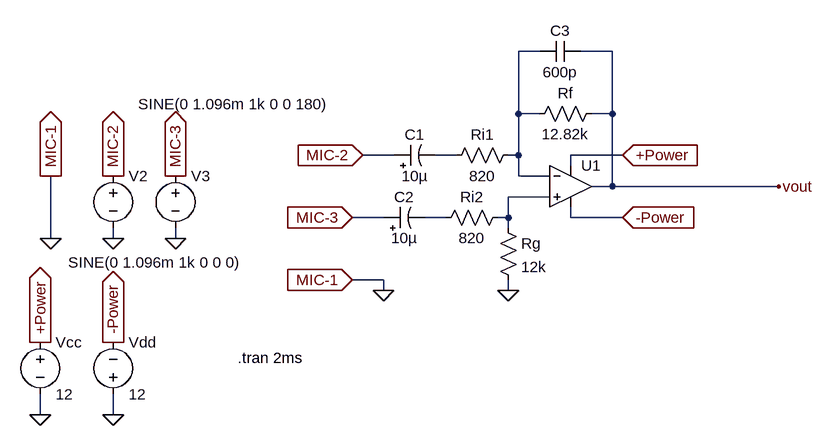
[diagram p0: schematic Mic Preamp.asc]
Mic Preamp.asc, the LTspice schematic file:
Version 4.1
SHEET 1 880 680
WIRE 304 -32 272 -32
WIRE 416 -32 368 -32
WIRE 272 64 272 -32
WIRE 304 64 272 64
WIRE 416 64 416 -32
WIRE 416 64 384 64
WIRE 80 128 32 128
WIRE 176 128 144 128
WIRE 272 128 272 64
WIRE 272 128 256 128
WIRE 432 128 352 128
WIRE 352 144 352 128
WIRE 272 160 272 128
WIRE 320 160 272 160
WIRE 416 176 416 64
WIRE 416 176 384 176
WIRE 672 176 416 176
WIRE 320 192 256 192
WIRE 64 224 16 224
WIRE 160 224 128 224
WIRE 256 224 256 192
WIRE 256 224 240 224
WIRE 352 224 352 208
WIRE 432 224 352 224
WIRE 256 240 256 224
WIRE -448 256 -448 160
WIRE -352 256 -352 240
WIRE -256 256 -256 240
WIRE 64 320 16 320
WIRE 64 336 64 320
WIRE 256 336 256 320
WIRE -464 528 -464 496
WIRE -352 528 -352 496
FLAG 432 128 +Power
IOPIN 432 128 In
FLAG 432 224 -Power
IOPIN 432 224 In
FLAG 256 336 0
FLAG 32 128 MIC-2
IOPIN 32 128 In
FLAG 16 224 MIC-3
IOPIN 16 224 In
FLAG 16 320 MIC-1
IOPIN 16 320 In
FLAG 64 336 0
FLAG -448 160 MIC-1
IOPIN -448 160 Out
FLAG -352 160 MIC-2
IOPIN -352 160 Out
FLAG -256 160 MIC-3
IOPIN -256 160 Out
FLAG -256 256 0
FLAG -352 256 0
FLAG -448 256 0
FLAG -352 416 -Power
IOPIN -352 416 Out
FLAG -464 416 +Power
IOPIN -464 416 Out
FLAG -464 528 0
FLAG -352 528 0
FLAG 672 176 vout
SYMBOL res 272 112 R90
WINDOW 0 0 56 VBottom 2
WINDOW 3 32 56 VTop 2
SYMATTR InstName Ri1
SYMATTR Value 820
SYMBOL res 256 208 R90
WINDOW 0 0 56 VBottom 2
WINDOW 3 32 56 VTop 2
SYMATTR InstName Ri2
SYMATTR Value 820
SYMBOL res 400 48 R90
WINDOW 0 0 56 VBottom 2
WINDOW 3 32 56 VTop 2
SYMATTR InstName Rf
SYMATTR Value 12.82k
SYMBOL res 240 224 R0
SYMATTR InstName Rg
SYMATTR Value 12k
SYMBOL voltage -352 144 R0
WINDOW 3 -69 149 Left 2
WINDOW 123 0 0 Left 0
WINDOW 39 0 0 Left 0
SYMATTR Value SINE(0 1.096m 1k 0 0 0)
SYMATTR InstName V2
SYMBOL voltage -256 144 R0
WINDOW 3 -57 -95 Left 2
WINDOW 123 0 0 Left 0
WINDOW 39 0 0 Left 0
SYMATTR Value SINE(0 1.096m 1k 0 0 180)
SYMATTR InstName V3
SYMBOL voltage -464 400 R0
WINDOW 123 0 0 Left 0
WINDOW 39 0 0 Left 0
SYMATTR InstName Vcc
SYMATTR Value 12
SYMBOL voltage -352 512 M180
WINDOW 0 24 96 Left 2
WINDOW 3 24 16 Left 2
WINDOW 123 0 0 Left 0
WINDOW 39 0 0 Left 0
SYMATTR InstName Vdd
SYMATTR Value 12
SYMBOL OpAmps\\UniversalOpAmp 352 176 R0
SYMATTR InstName U1
SYMBOL polcap 80 144 R270
WINDOW 0 32 32 VTop 2
WINDOW 3 0 32 VBottom 2
SYMATTR InstName C1
SYMATTR Value 10µ
SYMBOL polcap 64 240 R270
WINDOW 0 32 32 VTop 2
WINDOW 3 0 32 VBottom 2
SYMATTR InstName C2
SYMATTR Value 10µ
SYMBOL cap 368 -48 R90
WINDOW 0 0 32 VBottom 2
WINDOW 3 32 32 VTop 2
SYMATTR InstName C3
SYMATTR Value 600p
TEXT -160 440 Left 2 !.tran 2ms

The netlist it stands for:
* Mic Preamp.asc
Ri1 N001 N002 820
Ri2 N003 N004 820
Rf vout N001 12.82k
Rg N003 0 12k
V2 MIC-2 0 SINE(0 1.096m 1k 0 0 0)
V3 MIC-3 0 SINE(0 1.096m 1k 0 0 180)
Vcc +Power 0 12
Vdd 0 -Power 12
X§U1 N003 N001 +Power -Power vout level1 Avol=1Meg GBW=10Meg Vos=0 En=0 Enk=0 In=0 Ink=0 Rin=500Meg  ; pins In+ In- V+ V- OUT
C1 MIC-2 N002 10µ
C2 MIC-3 N004 10µ
C3 vout N001 600p
.tran 2ms
.lib UniversalOpAmp1.lib
.backanno
.end